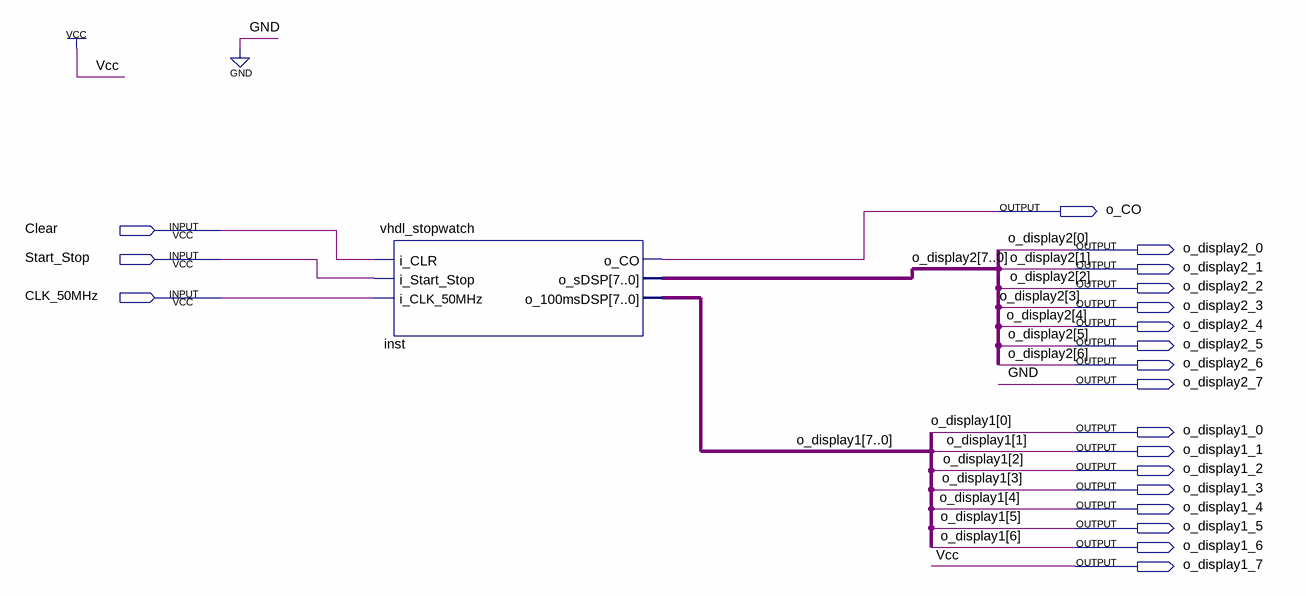
[diagram p0: schematic sheet]
// Quartus schematic vhdl_stopwatch_sch.bdf as structural Verilog: 1 symbols, 20 pins
module vhdl_stopwatch_sch (
  input  Clear,
  input  Start_Stop,
  input  CLK_50MHz,
  output o_CO,
  output o_display2_0,
  output o_display2_1,
  output o_display2_2,
  output o_display2_3,
  output o_display2_4,
  output o_display2_5,
  output o_display2_6,
  output o_display2_7,
  output o_display1_0,
  output o_display1_1,
  output o_display1_2,
  output o_display1_3,
  output o_display1_4,
  output o_display1_5,
  output o_display1_6,
  output o_display1_7
);

  wire [7:7] o_display1, o_display2;

  vhdl_stopwatch inst (
    .i_CLR(Clear), .i_Start_Stop(Start_Stop), .i_CLK_50MHz(CLK_50MHz), .o_CO(o_CO),
    .o_sDSP({o_display2[7], o_display2_6, o_display2_5, o_display2_4, o_display2_3, o_display2_2, o_display2_1, o_display2_0}),
    .o_100msDSP({o_display1[7], o_display1_6, o_display1_5, o_display1_4, o_display1_3, o_display1_2, o_display1_1, o_display1_0}));

  assign o_display1_7 = 1'b1;
  assign o_display2_7 = 1'b0;

  // Other names for the same wires on the sheet: o_display1[6:0] = {o_display1_6, o_display1_5, o_display1_4, o_display1_3, o_display1_2, o_display1_1, o_display1_0};
  //   o_display2[6:0] = {o_display2_6, o_display2_5, o_display2_4, o_display2_3, o_display2_2, o_display2_1, o_display2_0}
endmodule
